# Altium schematic sheet MCU.SchDoc
size A4; SheetNumber: 6; SheetTotal: 8
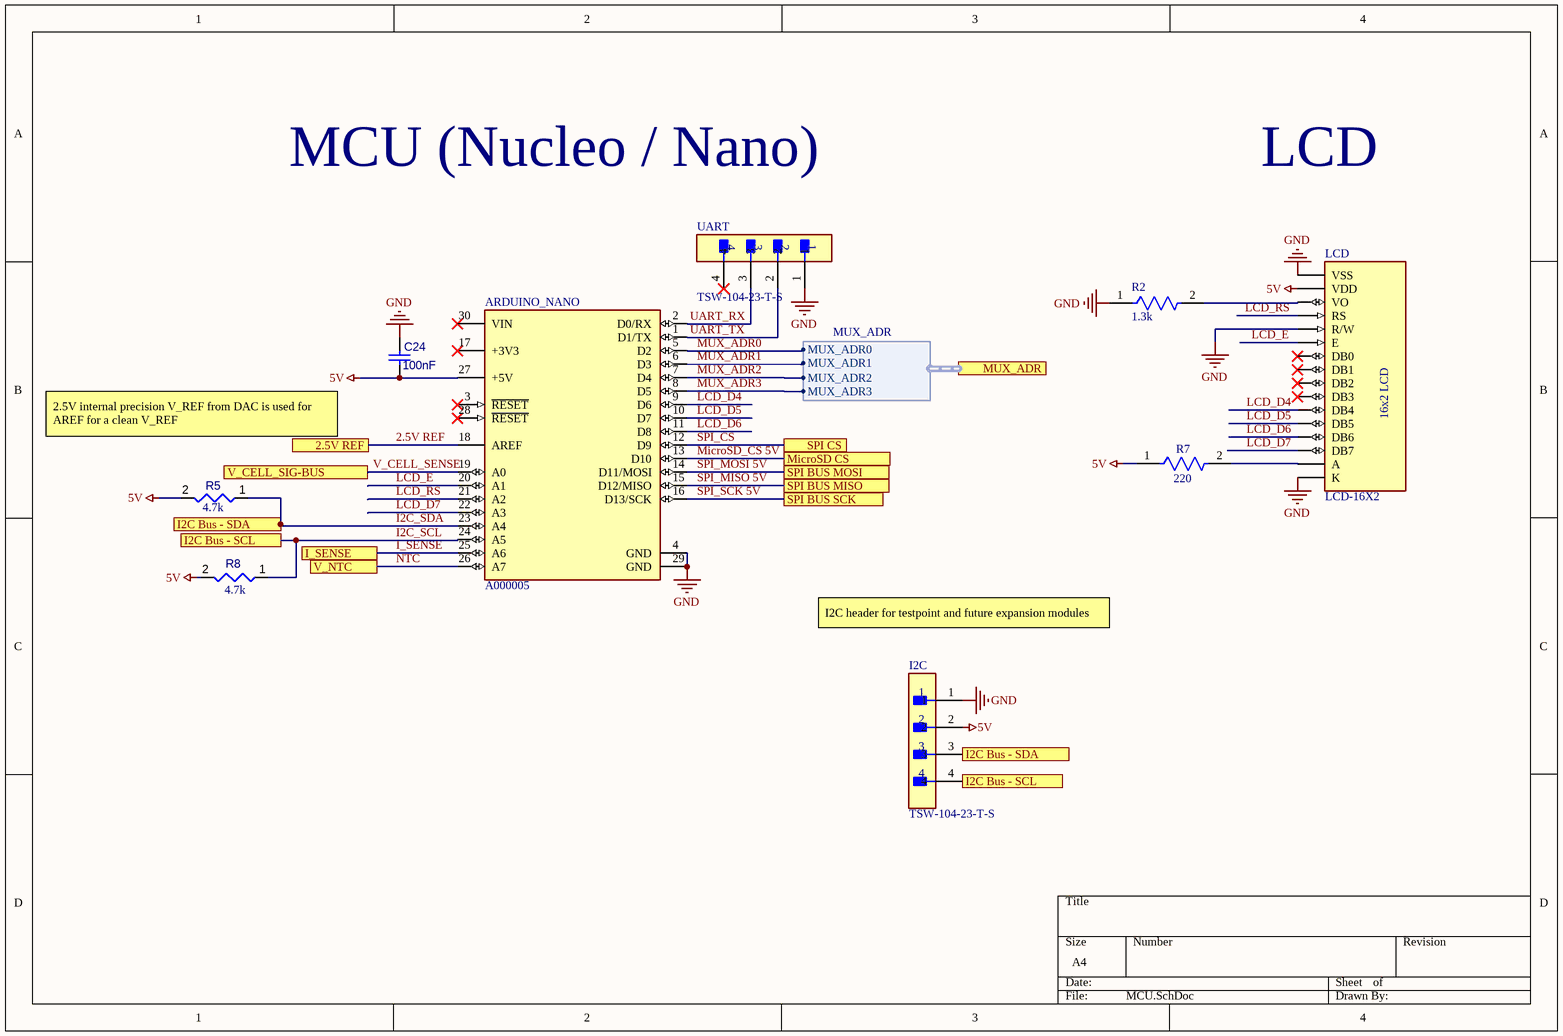
[diagram p0: MCU.SchDoc]

## Parts
ARDUINO_NANO  A000005  [FP-A000005-MFG]
C24  100nF  [CAPC2013X95X50LL10T25]
I2C  TSW-104-23-T-S  [FP-TSW-104-23-T-S-MFG]
LCD  LCD-16X2  [MODULE_LCD-16X2]
R2  1.3k  [FP-RMCF0805-IPC_B]
R5  value 4.7k  [RESC2013X70X40ML20T20]  (hidden comment: Resistor 4k7 +/-1% 0805 125 mW)
R7  220  [FP-RMCF0805-IPC_A]
R8  value 4.7k  [RESC2013X70X40ML20T20]  (hidden comment: Resistor 4k7 +/-1% 0805 125 mW)
UART  TSW-104-23-T-S  [FP-TSW-104-23-T-S-MFG]

## Ports
2.5V REF, I2C Bus - SCL, I2C Bus - SDA, I_SENSE, MicroSD CS, MUX_ADR (harness MUX_ADR), SPI BUS MISO, SPI BUS MOSI, SPI BUS SCK, SPI CS, V_CELL_SIG-BUS, V_NTC

## Harnesses
MUX_ADR: MUX_ADR0, MUX_ADR1, MUX_ADR2, MUX_ADR3

## Nets
5V: ARDUINO_NANO.27(+5V) C24.2 I2C.2 LCD.2(VDD) R5.2 R7.1 R8.2
GND: ARDUINO_NANO.4(GND) ARDUINO_NANO.29(GND) C24.1 I2C.1 LCD.1(VSS) LCD.5(R/W) LCD.16(K) R2.1 UART.1
2.5V REF: ARDUINO_NANO.18(AREF) ; port 2.5V REF
I2C_SCL: ARDUINO_NANO.24(A5) I2C.4 R8.1 ; port I2C Bus - SCL
I2C_SDA: ARDUINO_NANO.23(A4) I2C.3 R5.1 ; port I2C Bus - SDA
I_SENSE: ARDUINO_NANO.25(A6) ; port I_SENSE
LCD_D4: ARDUINO_NANO.9(D6) LCD.11(DB4)
LCD_D5: ARDUINO_NANO.10(D7) LCD.12(DB5)
LCD_D6: ARDUINO_NANO.11(D8) LCD.13(DB6)
LCD_D7: ARDUINO_NANO.22(A3) LCD.14(DB7)
LCD_E: ARDUINO_NANO.20(A1) LCD.6(E)
LCD_RS: ARDUINO_NANO.21(A2) LCD.4(RS)
MicroSD_CS 5V: ARDUINO_NANO.13(D10) ; port MicroSD CS
MUX_ADR0: ARDUINO_NANO.5(D2) ; port MUX_ADR.MUX_ADR0
MUX_ADR1: ARDUINO_NANO.6(D3) ; port MUX_ADR.MUX_ADR1
MUX_ADR2: ARDUINO_NANO.7(D4) ; port MUX_ADR.MUX_ADR2
MUX_ADR3: ARDUINO_NANO.8(D5) ; port MUX_ADR.MUX_ADR3
NTC: ARDUINO_NANO.26(A7) ; port V_NTC
SPI_CS: ARDUINO_NANO.12(D9) ; port SPI CS
SPI_MISO 5V: ARDUINO_NANO.15(D12/MISO) ; port SPI BUS MISO
SPI_MOSI 5V: ARDUINO_NANO.14(D11/MOSI) ; port SPI BUS MOSI
SPI_SCK 5V: ARDUINO_NANO.16(D13/SCK) ; port SPI BUS SCK
UART_RX: ARDUINO_NANO.2(D0/RX) UART.3
UART_TX: ARDUINO_NANO.1(D1/TX) UART.2
V_CELL_SENSE: ARDUINO_NANO.19(A0) ; port V_CELL_SIG-BUS
NetLCD_3: LCD.3(VO) R2.2
NetLCD_15: LCD.15(A) R7.2

Not connected (* = marked no-connect by the designer): ARDUINO_NANO 3(~{RESET})* 17(+3V3)* 28(~{RESET})* 30(VIN)*; LCD 7(DB0)* 8(DB1)* 9(DB2)* 10(DB3)*; UART 4*

## Notes on the sheet
- MCU (Nucleo / Nano)
- LCD
- 2.5V internal precision V_REF from DAC is used for AREF for a clean V_REF
- I2C header for testpoint and future expansion modules
- (in symbol CMP-008-000000-1) 16x2 LCD

## Library data of the parts
ARDUINO_NANO = CMP-189986-000002-1: ARDUINO NANO ATMEGA328 EVAL BRD; Number of Bits: 8; Evaluation Kit: Yes; Operating Supply Voltage: 12V; Interface: I2C; Data Bus Width: 8b; Core Architecture: AVR; Packaging: Bulk; Length: 7inch; Package Quantity: 50; Width: 5inch; REACH SVHC: No SVHC; Weight: 0.358383oz; Series: AVR® ATmega; Height: 0.25inch
C24 = CMP-001-00018-6: Capacitor 100 nF +/-10% 50 V 0805; Voltage Rating: 50V; Tolerance: 10%; Capacitor Type: Ceramic; Value: 100nF; Pins: 2; Max Operating Temperature: 125°C; Min Operating Temperature: -55°C; Mounting Technology: SM; Case/Package: 0805; RoHS Compliant: True
I2C UART = CMP-02766-001388-1: CONN HEADER VERT 4POS 2.54MM; Number of Contacts: 4; Gender: Male; Connector Type: Male Pin; Max Voltage Rating (AC): 550V; Max Current Rating: 7.6A; Radiation Hardening: No; Lead Free: Lead Free; RoHS Compliant: Yes; Contact Material: Bronze; Number of Positions: 4; Housing Color: Black; Min Operating Temperature: -55°C; Mount: Through Hole; Number of Rows: 1; Orientation: Straight; Contact Mating Length: 0.23inch; Contact Type: Male Pin; REACH SVHC: No SVHC; Max Operating Temperature: 105°C; Color: Black; Pitch: 2.54mm; Length: 10.16mm; Series: TSW; Packaging: Bulk; Contact Plating: Tin; Package Quantity: 1; Termination: Solder; Housing Material: Polyester; Width: 2.54mm; Depth: 2.54mm
LCD = CMP-008-000000-1: Display Development Tools 16x2 Black on Green Char LCD w Backlight; MF: Gravitech; MP: LCD-16X2; Pin Count: 16; Package: None; SnapEDA_Link: https://www.snapeda.com/parts/LCD-16X2/Gravitech/view-part/?ref=snap; Design Item ID: LCD-16X2; Source: LCD-16X2.SchLib; Check_prices: https://www.snapeda.com/parts/LCD-16X2/Gravitech/view-part/?ref=eda; Component Type: Standard; Value: *
R2 = CMP-26527-005916-1: 1.3kΩ ±5% 0.125W 0805 Thick Film Chip Resistor AEC-Q200 compliant; Max Power Dissipation: 125mW; Temperature Coefficient: 200ppm/°C; Resistance: 1.3kR; Mount: Surface Mount; Width: 0.049inch; Case/Package: 0805; Depth: 1.25mm; Case Code (Metric): 2012; Length: 0.079inch; Min Operating Temperature: -55°C; RoHS Compliant: Yes; Features: Automotive AEC-Q200; Number of Terminations: 2; Resistor Type: Thick Film; Packaging: Tape and Reel; Height: 0.026inch; Series: RMCF; Construction: Rectangular; Case Code (Imperial): 0805; Military Standard: Not; Tolerance: 5%; Max Operating Temperature: 155°C; Radiation Hardening: No; Package Quantity: 5000; Contact Plating: Tin
R5 R8 = CMP-009-00032-5: Chip Resistor, 4.7 KOhm, +/- 1%, 0.125 W, -55 to 155 degC, 0805 (2012 Metric); Power: 125mW; Voltage Rating: 150V; Mounting Technology: SM; RoHS Compliant: True; Tolerance: 1%; Min Operating Temperature: -55°C; Max Operating Temperature: 155°C; Case/Package: 0805; Pins: 2
R7 = CMP-26527-006932-1: 220Ω ±5% 0.125W 0805 Thick Film Chip Resistor AEC-Q200 compliant; Resistance: 220R; Max Power Dissipation: 125mW; Temperature Coefficient: 200ppm/°C; Min Operating Temperature: -55°C; Max Operating Temperature: 155°C; Military Standard: Not; Resistor Type: Thick Film; Radiation Hardening: No; Length: 0.079inch; Contact Plating: Tin; Number of Terminations: 2; Depth: 1.25mm; Construction: Rectangular; Width: 0.049inch; Case/Package: 0805; Case Code (Metric): 2012; Tolerance: 5%; Packaging: Tape and Reel; Lead Free: Lead Free; Series: RMCF; RoHS Compliant: Yes; Mount: Surface Mount; Case Code (Imperial): 0805; Features: Automotive AEC-Q200; Height: 0.026inch